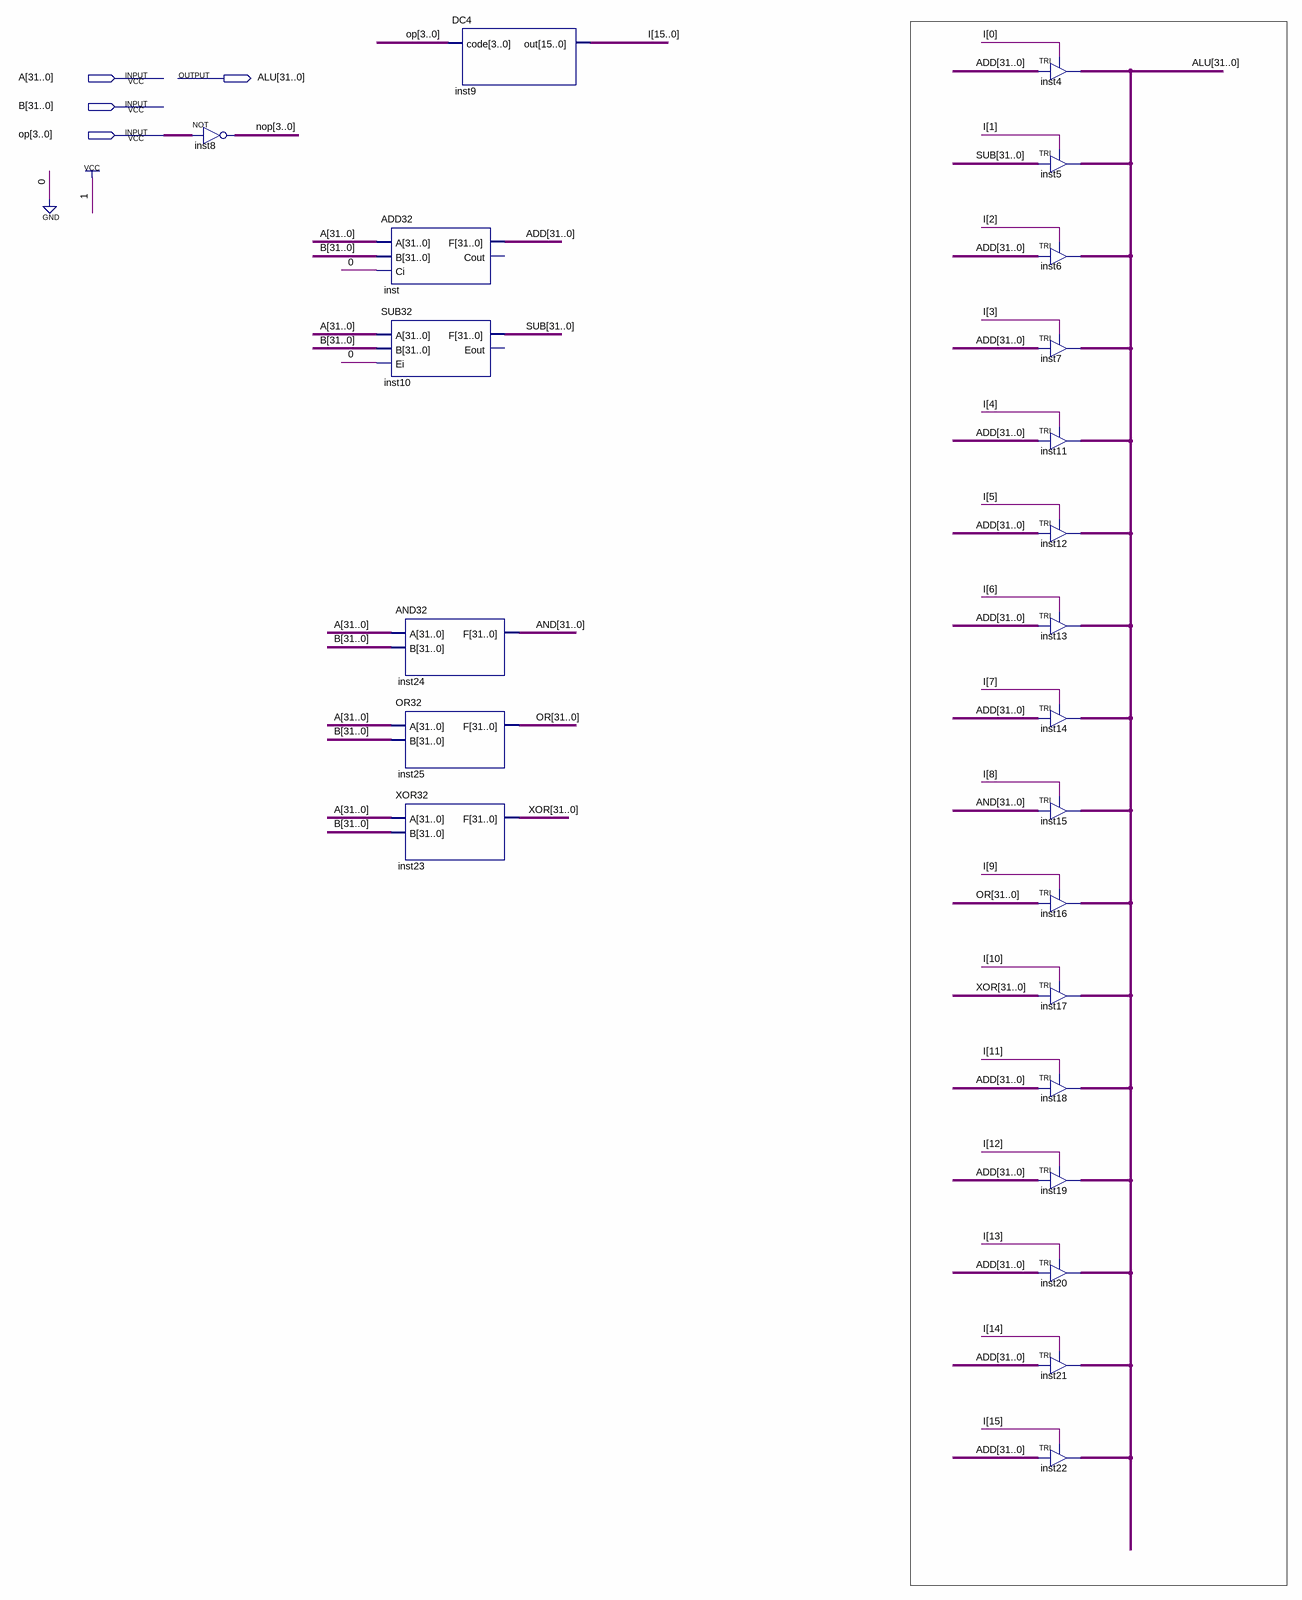
[diagram p0: schematic sheet]
// Quartus schematic ALU32.bdf as structural Verilog: 23 symbols, 4 pins
module ALU32 (
  input  [31:0] A,
  input  [31:0] B,
  input  [3:0] op,
  output [31:0] ALU
);

  wire [3:0] nop;
  wire [15:0] I;
  wire [31:0] ADD, AND, OR, SUB, XOR;

  assign nop = ~op;  // NOT inst8, 4 bits wide
  ADD32 inst (.A(A), .B(B), .Ci(1'b0), .F(ADD));  // open: Cout
  SUB32 inst10 (.A(A), .B(B), .Ei(1'b0), .F(SUB));  // open: Eout
  AND32 inst24 (.A(A), .B(B), .F(AND));
  OR32 inst25 (.A(A), .B(B), .F(OR));
  XOR32 inst23 (.A(A), .B(B), .F(XOR));
  DC4 inst9 (.code(op), .out(I));
  TRI inst4[31:0] (.IN(ADD), .OE(I[0]), .OUT(ALU));
  TRI inst5[31:0] (.IN(SUB), .OE(I[1]), .OUT(ALU));
  TRI inst6[31:0] (.IN(ADD), .OE(I[2]), .OUT(ALU));
  TRI inst7[31:0] (.IN(ADD), .OE(I[3]), .OUT(ALU));
  TRI inst11[31:0] (.IN(ADD), .OE(I[4]), .OUT(ALU));
  TRI inst12[31:0] (.IN(ADD), .OE(I[5]), .OUT(ALU));
  TRI inst13[31:0] (.IN(ADD), .OE(I[6]), .OUT(ALU));
  TRI inst14[31:0] (.IN(ADD), .OE(I[7]), .OUT(ALU));
  TRI inst15[31:0] (.IN(AND), .OE(I[8]), .OUT(ALU));
  TRI inst16[31:0] (.IN(OR), .OE(I[9]), .OUT(ALU));
  TRI inst17[31:0] (.IN(XOR), .OE(I[10]), .OUT(ALU));
  TRI inst18[31:0] (.IN(ADD), .OE(I[11]), .OUT(ALU));
  TRI inst19[31:0] (.IN(ADD), .OE(I[12]), .OUT(ALU));
  TRI inst20[31:0] (.IN(ADD), .OE(I[13]), .OUT(ALU));
  TRI inst21[31:0] (.IN(ADD), .OE(I[14]), .OUT(ALU));
  TRI inst22[31:0] (.IN(ADD), .OE(I[15]), .OUT(ALU));
endmodule
